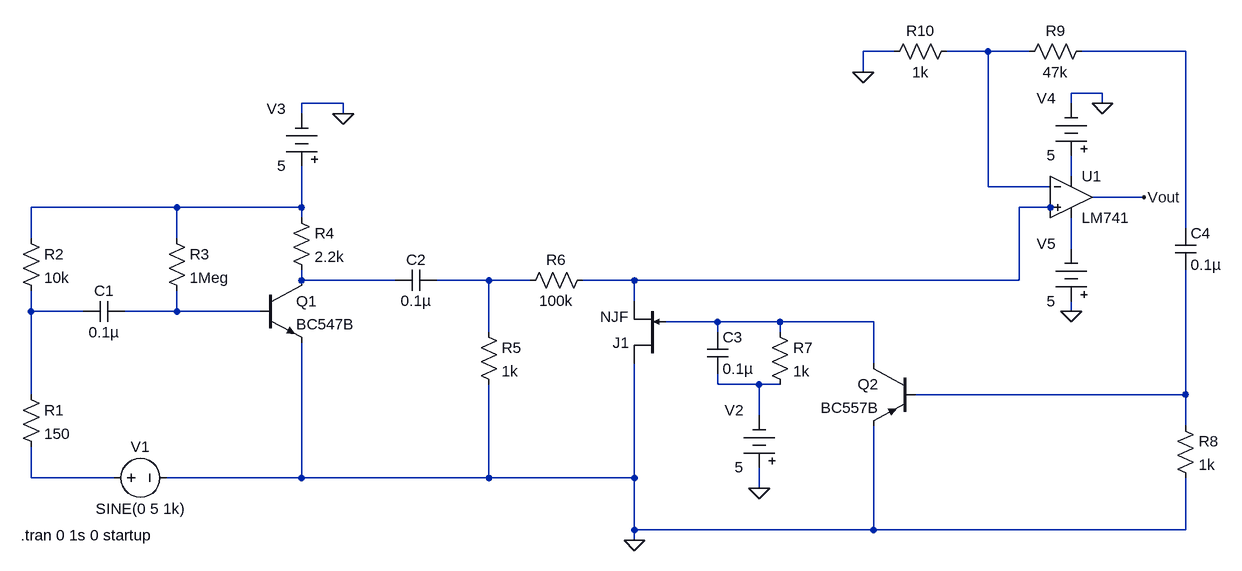
[diagram p0: schematic AEC PROJECT.asc]
AEC PROJECT.asc, the LTspice schematic file:
Version 4
SHEET 1 4516 696
WIRE 1168 -112 1120 -112
WIRE 1312 -112 1248 -112
WIRE 1376 -112 1312 -112
WIRE 1616 -112 1456 -112
WIRE 1120 -80 1120 -112
WIRE 1488 -48 1440 -48
WIRE 320 -32 256 -32
WIRE 1440 -32 1440 -48
WIRE 1488 -32 1488 -48
WIRE 256 -16 256 -32
WIRE 320 -16 320 -32
WIRE 1440 80 1440 48
WIRE 1312 96 1312 -112
WIRE 1408 96 1312 96
WIRE 1552 112 1472 112
WIRE 64 128 -160 128
WIRE 256 128 256 64
WIRE 256 128 64 128
WIRE 1408 128 1360 128
WIRE 1424 128 1408 128
WIRE 256 144 256 128
WIRE 1616 160 1616 -112
WIRE -160 176 -160 128
WIRE 64 176 64 128
WIRE 1440 192 1440 144
WIRE 256 240 256 224
WIRE 400 240 256 240
WIRE 544 240 464 240
WIRE 608 240 544 240
WIRE 768 240 688 240
WIRE 1360 240 1360 128
WIRE 1360 240 768 240
WIRE 768 272 768 240
WIRE -160 288 -160 256
WIRE -80 288 -160 288
WIRE 64 288 64 256
WIRE 64 288 -16 288
WIRE 192 288 64 288
WIRE 1440 288 1440 272
WIRE 896 304 816 304
WIRE 992 304 896 304
WIRE 1136 304 992 304
WIRE 544 320 544 240
WIRE 896 320 896 304
WIRE 992 320 992 304
WIRE 1136 368 1136 304
WIRE 896 400 896 384
WIRE 960 400 896 400
WIRE 992 400 960 400
WIRE -160 416 -160 288
WIRE 1616 416 1616 224
WIRE 1616 416 1200 416
WIRE 960 448 960 400
WIRE 1616 464 1616 416
WIRE -160 544 -160 496
WIRE -32 544 -160 544
WIRE 256 544 256 336
WIRE 256 544 48 544
WIRE 544 544 544 400
WIRE 544 544 256 544
WIRE 768 544 768 368
WIRE 768 544 544 544
WIRE 960 560 960 528
WIRE 768 624 768 544
WIRE 1136 624 1136 464
WIRE 1136 624 768 624
WIRE 1616 624 1616 544
WIRE 1616 624 1136 624
WIRE 768 640 768 624
FLAG 320 -16 0
FLAG 960 560 0
FLAG 1488 -32 0
FLAG 1440 288 0
FLAG 1120 -80 0
FLAG 768 640 0
FLAG 1552 112 Vout
DATAFLAG 1328 128 ""
SYMBOL res -176 400 R0
SYMATTR InstName R1
SYMATTR Value 150
SYMBOL res -176 160 R0
SYMATTR InstName R2
SYMATTR Value 10k
SYMBOL res 48 160 R0
SYMATTR InstName R3
SYMATTR Value 1Meg
SYMBOL cap -16 272 R90
WINDOW 0 0 32 VBottom 2
WINDOW 3 32 32 VTop 2
SYMATTR InstName C1
SYMATTR Value 0.1µ
SYMBOL voltage -48 544 R270
WINDOW 0 32 56 VTop 2
WINDOW 3 -32 56 VBottom 2
WINDOW 39 0 0 Left 0
SYMATTR InstName V1
SYMATTR Value SINE(0 5 1k)
SYMATTR Value2 AC 25m
SYMBOL npn2 192 240 R0
SYMATTR InstName Q1
SYMATTR Value BC547B
SYMBOL res 240 128 R0
SYMATTR InstName R4
SYMATTR Value 2.2k
SYMBOL cap 464 224 R90
WINDOW 0 0 32 VBottom 2
WINDOW 3 32 32 VTop 2
SYMATTR InstName C2
SYMATTR Value 0.1µ
SYMBOL res 528 304 R0
SYMATTR InstName R5
SYMATTR Value 1k
SYMBOL res 704 224 R90
WINDOW 0 0 56 VBottom 2
WINDOW 3 32 56 VTop 2
SYMATTR InstName R6
SYMATTR Value 100k
SYMBOL njf 816 368 R180
SYMATTR InstName J1
SYMBOL cap 880 320 R0
SYMATTR InstName C3
SYMATTR Value 0.1µ
SYMBOL res 976 304 R0
SYMATTR InstName R7
SYMATTR Value 1k
SYMBOL Misc\\battery 256 80 R180
WINDOW 0 24 104 Left 2
WINDOW 3 24 16 Left 2
WINDOW 123 0 0 Left 0
WINDOW 39 0 0 Left 0
SYMATTR InstName V3
SYMATTR Value 5
SYMBOL Misc\\battery 960 544 R180
WINDOW 0 24 104 Left 2
WINDOW 3 24 16 Left 2
WINDOW 123 0 0 Left 0
WINDOW 39 0 0 Left 0
SYMATTR InstName V2
SYMATTR Value 5
SYMBOL pnp2 1200 368 M0
SYMATTR InstName Q2
SYMATTR Value BC557B
SYMBOL OpAmps\\LM741 1440 48 R0
SYMATTR InstName U1
SYMBOL Misc\\battery 1440 64 R180
WINDOW 0 24 104 Left 2
WINDOW 3 24 16 Left 2
WINDOW 123 0 0 Left 0
WINDOW 39 0 0 Left 0
SYMATTR InstName V4
SYMATTR Value 5
SYMBOL Misc\\battery 1440 288 R180
WINDOW 0 24 104 Left 2
WINDOW 3 24 16 Left 2
WINDOW 123 0 0 Left 0
WINDOW 39 0 0 Left 0
SYMATTR InstName V5
SYMATTR Value 5
SYMBOL cap 1600 160 R0
SYMATTR InstName C4
SYMATTR Value 0.1µ
SYMBOL res 1600 448 R0
SYMATTR InstName R8
SYMATTR Value 1k
SYMBOL res 1472 -128 R90
WINDOW 0 0 56 VBottom 2
WINDOW 3 32 56 VTop 2
SYMATTR InstName R9
SYMATTR Value 47k
SYMBOL res 1264 -128 R90
WINDOW 0 0 56 VBottom 2
WINDOW 3 32 56 VTop 2
SYMATTR InstName R10
SYMATTR Value 1k
TEXT -176 632 Left 2 !.tran 0 1s 0 startup

The netlist it stands for:
* AEC PROJECT.asc
R1 N009 N014 150
R2 N004 N009 10k
R3 N004 N010 1Meg
C1 N010 N009 0.1µ
V1 N014 0 SINE(0 5 1k) AC 25m
Q1 N007 N010 0 0 BC547B
R4 N004 N007 2.2k
C2 N008 N007 0.1µ
R5 N008 0 1k
R6 N005 N008 100k
J1 0 N011 N005 NJF
C3 N011 N012 0.1µ
R7 N011 N012 1k
V3 N004 0 5
V2 0 N012 5
Q2 N011 N013 0 0 BC557B
XU1 N005 N001 N003 N006 Vout LM741  ; pins In+ In- V+ V- OUT
V4 N003 0 5
V5 0 N006 5
C4 N002 N013 0.1µ
R8 N013 0 1k
R9 N002 N001 47k
R10 N001 0 1k
.model NPN NPN
.model PNP PNP
.lib standard.bjt
.model NJF NJF
.model PJF PJF
.lib standard.jft
.tran 0 1s 0 startup
.lib LM741.lib
.backanno
.end